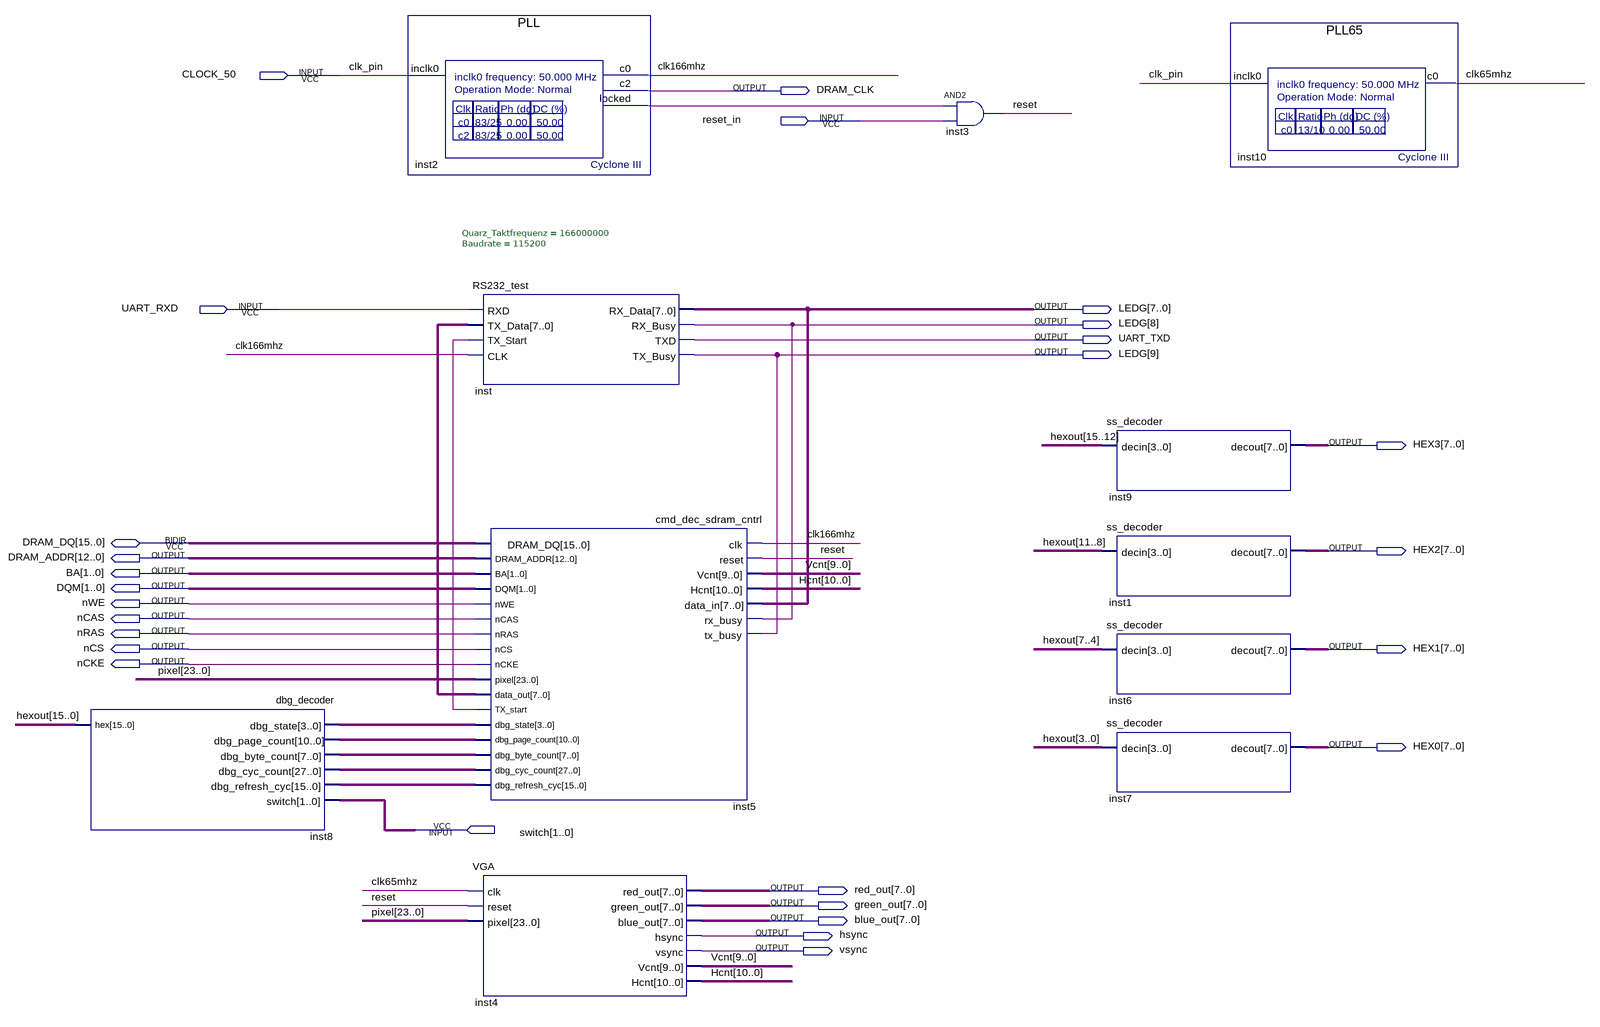
[diagram p0: schematic sheet]
// Quartus schematic top.bdf as structural Verilog: 11 symbols, 27 pins
module top (
  input  CLOCK_50,
  input  reset_in,
  input  UART_RXD,
  input  [1:0] switch,
  inout  [15:0] DRAM_DQ,
  output DRAM_CLK,
  output [9:0] LEDG,
  output UART_TXD,
  output [7:0] HEX3,
  output [7:0] HEX2,
  output [12:0] DRAM_ADDR,
  output [1:0] BA,
  output [1:0] DQM,
  output nWE,
  output nCAS,
  output nRAS,
  output nCS,
  output [7:0] HEX1,
  output nCKE,
  output [7:0] HEX0,
  output [7:0] red_out,
  output [7:0] green_out,
  output [7:0] blue_out,
  output hsync,
  output vsync
);

  wire clk65mhz, clk166mhz, inst2_locked, inst5_tx_start, reset;
  wire [3:0] inst5_dbg_state;
  wire [7:0] inst5_data_out, inst5_dbg_byte_count;
  wire [9:0] Vcnt;
  wire [10:0] Hcnt, inst5_dbg_page_count;
  wire [15:0] hexout, inst5_dbg_refresh_cyc;
  wire [23:0] pixel;
  wire [27:0] inst5_dbg_cyc_count;

  dbg_decoder inst8 (
    .dbg_state(inst5_dbg_state), .dbg_page_count(inst5_dbg_page_count),
    .dbg_byte_count(inst5_dbg_byte_count), .dbg_cyc_count(inst5_dbg_cyc_count),
    .dbg_refresh_cyc(inst5_dbg_refresh_cyc), .switch(switch), .hex(hexout));
  PLL inst2 (.inclk0(CLOCK_50), .c0(clk166mhz), .c2(DRAM_CLK), .locked(inst2_locked));
  RS232_test #(.Quarz_Taktfrequenz(166000000), .Baudrate(115200)) inst (
    .RXD(UART_RXD), .TX_Data(inst5_data_out), .TX_Start(inst5_tx_start), .CLK(clk166mhz),
    .RX_Data(LEDG[7:0]), .RX_Busy(LEDG[8]), .TXD(UART_TXD), .TX_Busy(LEDG[9]));
  cmd_dec_sdram_cntrl inst5 (
    .clk(clk166mhz), .reset(reset), .Vcnt(Vcnt), .Hcnt(Hcnt), .data_in(LEDG[7:0]), .rx_busy(LEDG[8]),
    .tx_busy(LEDG[9]), .DRAM_ADDR(DRAM_ADDR), .BA(BA), .DQM(DQM), .nWE(nWE), .nCAS(nCAS), .nRAS(nRAS),
    .nCS(nCS), .nCKE(nCKE), .pixel(pixel), .data_out(inst5_data_out), .TX_start(inst5_tx_start),
    .dbg_state(inst5_dbg_state), .dbg_page_count(inst5_dbg_page_count),
    .dbg_byte_count(inst5_dbg_byte_count), .dbg_cyc_count(inst5_dbg_cyc_count),
    .dbg_refresh_cyc(inst5_dbg_refresh_cyc), .DRAM_DQ(DRAM_DQ));
  VGA inst4 (
    .clk(clk65mhz), .reset(reset), .pixel(pixel), .red_out(red_out), .green_out(green_out),
    .blue_out(blue_out), .hsync(hsync), .vsync(vsync), .Vcnt(Vcnt), .Hcnt(Hcnt));
  and inst3 (reset, inst2_locked, reset_in);
  ss_decoder inst9 (.decin(hexout[15:12]), .decout(HEX3));
  ss_decoder inst1 (.decin(hexout[11:8]), .decout(HEX2));
  ss_decoder inst6 (.decin(hexout[7:4]), .decout(HEX1));
  ss_decoder inst7 (.decin(hexout[3:0]), .decout(HEX0));
  PLL65 inst10 (.inclk0(CLOCK_50), .c0(clk65mhz));

  // Other names for the same wires on the sheet: clk_pin = CLOCK_50
endmodule
